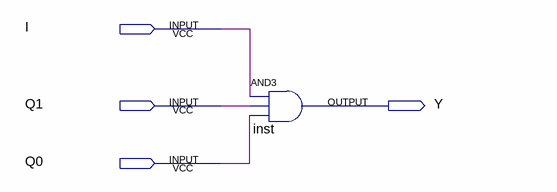
[diagram p0: schematic sheet]
// Quartus schematic Y.bdf as structural Verilog: 1 symbols, 4 pins
module Y (
  input  I,
  input  Q1,
  input  Q0,
  output Y
);

  and inst (Y, I, Q1, Q0);
endmodule
